# Altium schematic sheet MIO_SD.SchDoc
size A3; SheetNumber: 4; SheetTotal: 13
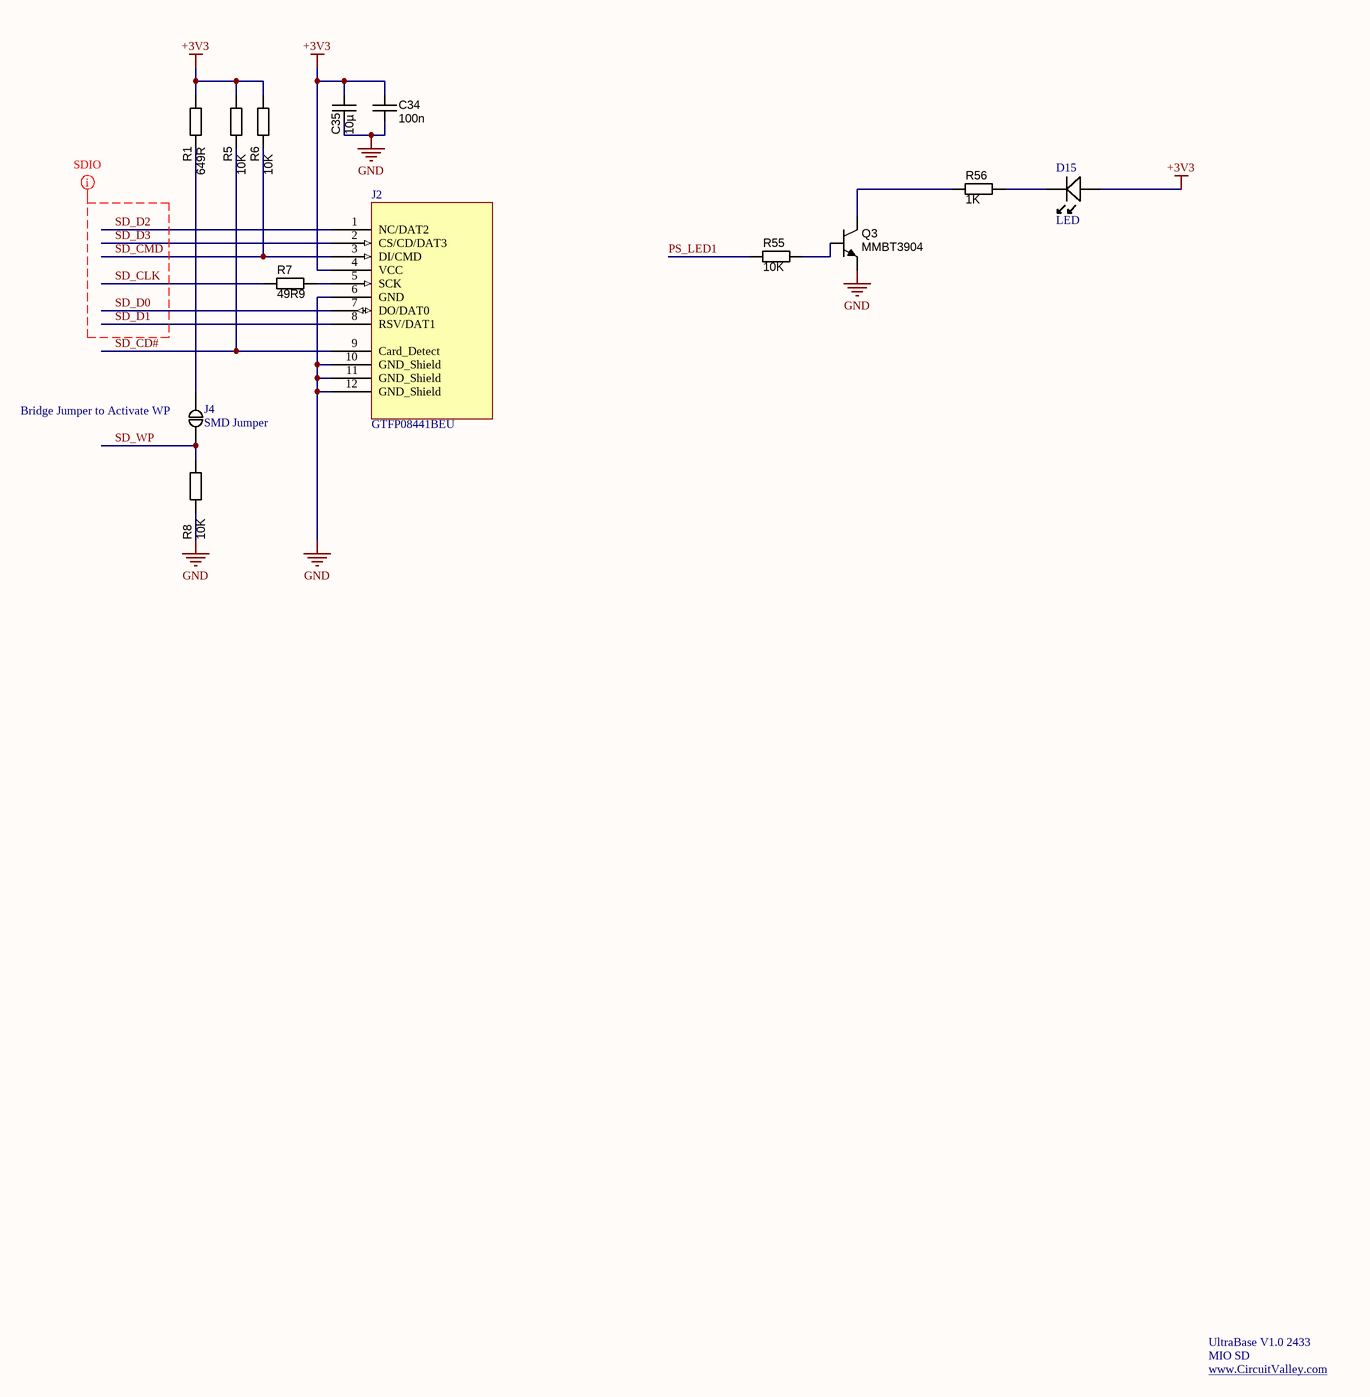
[diagram p0: MIO_SD.SchDoc]

## Parts
C34  100n  [CAPC1608N]
C35  10µ  [CAPC3225N]
D15  LED  [1206_LED]
J2  GTFP08441BEU  [GTFP08441BEU]
J4  SMD Jumper  [SMD_Jumper]  (net tie, no BOM)
Q3  Manufacturer Part Number 1: MMBT3904  [SOT23-3]  (hidden comment: NPN_MMBT3904)
R1  value 649R  [RESC1608N]  (hidden comment: RES_NL_0603)
R5  value 10K  [RESC1608N]  (hidden comment: RES_NL_0603)
R6  value 10K  [RESC1608N]  (hidden comment: RES_NL_0603)
R7  value 49R9  [RESC1608N]  (hidden comment: RES_NL_0603)
R8  value 10K  [RESC1608N]  (hidden comment: RES_NL_0603)
R55  value 10K  [RESC1608N]  (hidden comment: RES_NL_0603)
R56  value 1K  [RESC1608N]  (hidden comment: RES_NL_0603)

## Nets
+3V3: C34.1 C35.1 D15.A J2.4(VCC) R1.1 R5.1 R6.1
GND: C34.2 C35.2 J2.6(GND) J2.10(GND_Shield) J2.11(GND_Shield) J2.12(GND_Shield) Q3.2(E) R8.2
PS_LED1: R55.1
SD_CD#: J2.9(Card_Detect) R5.2
SD_CLK: R7.1
SD_CMD: J2.3(DI/CMD) R6.2
SD_D0: J2.7(DO/DAT0)
SD_D1: J2.8(RSV/DAT1)
SD_D2: J2.1(NC/DAT2)
SD_D3: J2.2(CS/CD/DAT3)
SD_WP: J4.1 R8.1
NetD15_K: D15.K R56.2
NetJ2_5: J2.5(SCK) R7.2
NetJ4_2: J4.2 R1.2
NetQ3_1: Q3.1(B) R55.2
NetQ3_3: Q3.3(C) R56.1

## Layout directives
net class SDIO: SD_CLK, SD_CMD, SD_D0, SD_D1, SD_D2, SD_D3

## Notes on the sheet
- (near J4) Bridge Jumper to Activate WP
- UltraBase V1.0 2433
- MIO SD
- www.CircuitValley.com <http://www.CircuitValley.com>

## Library data of the parts
C34 = CAPC_1n_0603_100V: Capacitor SMD Cer 1nF 10% 100V X7R 0603; Manufacturer 1: Murata Electronics North America; Manufacturer Part Number 1: GCM188R72A102KA37D; Ratings: 100V; X7R; Material: ceramic; Package / Case: 0603 (1608 metric); Tolerance: ±10%; Supplier 1: Digi-Key; Supplier Part Number 1: 490-4780-1-ND; Operating Temperature: -55°C ~ 125°C; Size / Dimension: 0.063" L x 0.031" W (1.60mm x 0.80mm); Thickness (Max): 0.035" (0.90mm); ComponentLink1URL: http://search.murata.co.jp/Ceramy/image/img/PDF/ENG/GCM188R72A102KA37.pdf; ComponentLink1Description: http://search.murata.co.jp/Ceramy/image/img/PDF/ENG/GCM188R72A102KA37.pdf; Value: 100n
C35 = CAPC_10u_1210_50V: Capacitor SMD Cer 10uF 20% 16V X5R 1210; Manufacturer 1: Taiyo Yuden; Manufacturer Part Number 1: UMK325BJ106MM-T; Ratings: 50V; X5R; Material: ceramic; Package / Case: 1210 (3225 Metric); Tolerance: ±20%; Size / Dimension: 0.126" L x 0.098" W (3.20mm x 2.50mm); Supplier 1: Digi-Key; Supplier Part Number 1: 587-2225-1-ND; Value: 10µ
J2 = GTFP08441BEU: MicroSD card
J4 = SMD_Jumper
Q3 = NPN_MMBT3904: Transistor SMD NPN 40V 0.2A 350mW SOT-23; Manufacturer 1: Fairchild Semiconductor; Ratings: 40V; 200mA; 350mW; Material: Si; Package / Case: SOT-23; Supplier 1: Digi-Key; Supplier Part Number 1: MMBT3904FSCT-ND; Transistor Type: NPN; Mounting Type: Surface Mount
R1 R5-R8 R55 R56 = RES_NL_0603: Resistor, SMD chip; Manufacturer 1: Royal Ohm; Ratings: 1/10 W; Tolerance: ±5%; Package / Case: 0603 (1608 metric)